# Altium project Mach_3V_5V.PrjPcb
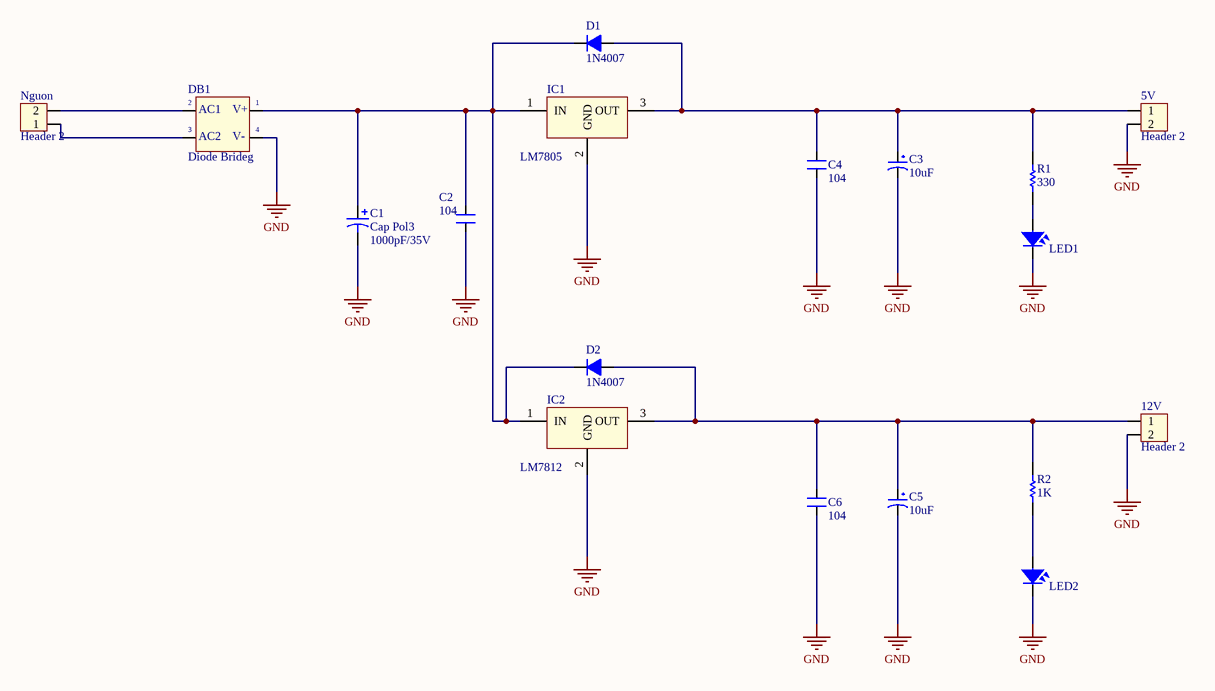
[diagram p0: Shematic.SchDoc]
1 sheet, 18 parts. Net scope: global (net labels, ports and power ports of the same name join across sheets).
Board file: PCB.PcbDoc

## Sheet Shematic.SchDoc
size A4; Organization: Altium Limited; Address1: L3, 12a Rodborough Rd; Address2: Frenchs Forest; Address3: NSW; Address4: Australia 2086

### Parts
5V  Header 2  [HED2]
12V  Header 2  [HED2]
C1  Cap Pol3  value 1000pF/35V  [CP2/5]
C2  104  [CN2]
C3  10uF  [CP1/2]
C4  104  [CN2]
C5  10uF  [CP1/2]
C6  104  [CN2]
D1  1N4007  [D1A]
D2  1N4007  [D1A]
DB1  Diode Brideg  [CAU 1A]
IC1  LM7805  [QTO-220]
IC2  LM7812  [QTO-220]
LED1  LED  [LED-3]  (value not drawn)
LED2  LED  [LED-3]  (value not drawn)
Nguon  Header 2  [HED2]
R1  value 330  [R1/4W]  (hidden comment: Res1)
R2  value 1K  [R1/4W]  (hidden comment: Res1)

### Nets
GND: 5V.2 12V.2 C1.2 C2.1 C3.2 C4.1 C5.2 C6.1 DB1.4(-V_OUT) IC1.2(GND) IC2.2(GND) LED1.2 LED2.2
Net5V_1: 5V.1 C3.1 C4.2 D1.1(A) IC1.3(OUT) R1.2
Net12V_1: 12V.1 C5.1 C6.2 D2.1(A) IC2.3(OUT) R2.2
NetC1_1: C1.1 C2.2 D1.2(K) D2.2(K) DB1.1(+V_OUT) IC1.1(IN) IC2.1(IN)
NetDB1_2: DB1.2(AC1) Nguon.2
NetDB1_3: DB1.3(AC2) Nguon.1
NetLED1_1: LED1.1 R1.1
NetLED2_1: LED2.1 R2.1

### Notes on the sheet
- Title
- Size:
- Date:
- A4
- Number:
- Time:
- Revision:
- Sheet
- of
- File:
- (in symbol DB) V+; V-

### Library data of the parts
5V 12V Nguon = Hed2: Header 2 (Green); Value: Header 2
C1 = Cap Pol3_2: Polarized Capacitor (Surface Mount); VALUE: C?; LatestRevisionDate: 17-Jul-2002; LatestRevisionNote: Re-released for DXP Platform.; PackageReference: C0805; Publisher: Altium Limited
C2 C4 C6 = CN2: Cap np 104 => 105pF; Value: 0.1uF
C3 C5 = CP1: Cap P  0,1uF < 22uF , 16 - 50V; Value: 10uF/50V; Description 1: 10 => 220uF/6,3V/10V - 10uF => 100uF/16V; Description 2: 0,1uF => 33uF/50V - 10uF => 22uF/63V; Description 3: 0,47uF => 10uF/100V
D1 D2 = D1A: Diode 1A; Value: 1N4007
DB1 = DB: Convert AC to DC voltage, 4 pin; Value: Cau 1A
IC1 = LM78xx: On ap +, from + 5 to + 24VDC; Value: LM7805
IC2 = LM78xx: On ap +, from + 5 to + 24VDC; Value: LM7805
LED1 LED2 = LED: LED Single colour Green and Red; Value: LED 3 ly Single Colour
R1 R2 = Res1_1: Resistor; Manufacturer: Generic Components; Class: Passive; Published: 08/06/2000; Publisher: Altium Hobart Technology Centre; SubClass: Resistor